# Altium schematic sheet Game of Simon.SchDoc
size A4
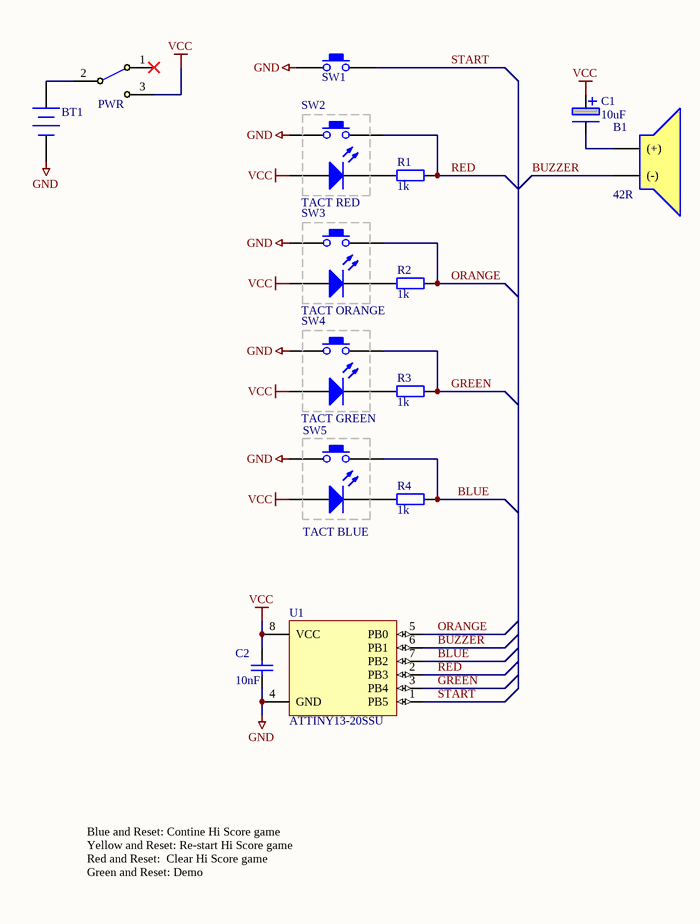
[diagram p0: Game of Simon.SchDoc]

## Parts
B1  42R  [BUZZER]
BT1  CR2032 Battery Holder  [CR2032 HOLDER]  (value not drawn)
C1  10uF  [CAP ELECTRO 5mm]
C2  10nF  [CAP 0.100"]
PWR  SS12D00G3  [SS12D00G3]  (value not drawn)
R1  1k  [RESISTOR 0.400"]
R2  1k  [RESISTOR 0.400"]
R3  1k  [RESISTOR 0.400"]
R4  1k  [RESISTOR 0.400"]
SW1  12MM TACT SWITCH  [12mm TACT THROUGH HOLE]  (value not drawn)
SW2  TACT RED  [ILLUMINATED TACT RED]
SW3  TACT ORANGE  [ILLUMINATED TACT ORANGE]
SW4  TACT GREEN  [ILLUMINATED TACT GREEN]
SW5  TACT BLUE  [ILLUMINATED TACT BLUE]
U1  ATTINY13-20SSU  [DIP-8]

## Nets
GND: BT1.2(-) C2.2 SW1.1 SW2.1 SW3.1 SW4.1 SW5.1 U1.4(GND)
VCC: C1.1 C2.1 PWR.3 SW2.K SW3.K SW4.K SW5.K U1.8(VCC)
BLUE: R4.2 SW5.2 U1.7(PB2)
BUZZER: B1.2((-)) U1.6(PB1)
GREEN: R3.2 SW4.2 U1.3(PB4)
ORANGE: R2.2 SW3.2 U1.5(PB0)
RED: R1.2 SW2.2 U1.2(PB3)
START: SW1.2 U1.1(PB5)
NetB1_1: B1.1((+)) C1.2
NetBT1_1: BT1.1(+) PWR.2
NetR1_1: R1.1 SW2.A
NetR2_1: R2.1 SW3.A
NetR3_1: R3.1 SW4.A
NetR4_1: R4.1 SW5.A

Not connected (* = marked no-connect by the designer): PWR 1*

## Notes on the sheet
- Blue and Reset: Contine Hi Score game
  Yellow and Reset: Re-start Hi Score game
  Red and Reset:  Clear Hi Score game
  Green and Reset: Demo
- LOW COST LABS
- Title
- Size:
- Date:
- A4
- Number:
- Revision:
- Sheet
- of
- File:

## Library data of the parts
B1 = BUZZER
BT1 = CMP-dvcba8mzfnv4aqscf1uc-2: CR2032 Battery Holder, Through Hole, Horizontal Mount; CustomComponentID: dvcba8mzfnv4aqscf1uc
C1 = CMP-su2zmkw1kc3z49ns9isd-1: 5mm Through Hole Electrolytic 2mm Pitch, 5mm height; CustomComponentID: su2zmkw1kc3z49ns9isd
C2 = CMP-f9eb30fd1b76262c-1: Capacitor, Ceramic, 10000pF, 50VDC, 20-% Tol, 20+% Tol, X7R-TC Code, -15, 15%-TC; Manufacturer Part Number: C315C103M5R5TA; Octopart URL: http://octopart.com/c315c103m5r5ta-kemet-1886203; RoHS: Compliant; Mounting Style: Through Hole; OctopartID: f9eb30fd1b76262c
PWR = SS12D00G3 Toggle Switch
R1-R4 = CMP-iaxfckaaxq3jb0c9euu5-1: RESISITOR THROUGH HOLE 1/4W; CustomComponentID: iaxfckaaxq3jb0c9euu5
SW1 = 12MM TACT SWITCH: CustomComponentID: pjmxh7vitsno3jubi8oz
SW2 = TACT RED: 12mm TACT SWITCH RED
SW3 = TACT ORANGE: 12mm TACT SWITCH ORANGE
SW4 = TACT GREEN: 12mm TACT SWITCH GREEN
SW5 = TACT BLUE: ILLUMINATED 12MM TACT SWITCH (BLUE); CustomComponentID: pjmxh7vitsno3jubi8oz
U1 = ATTINY13-20SSU: ATtiny Series 20 MHz 1 KB Flash 64 B SRAM 8-Bit Microcontroller - SOIC-8; MF: Microchip; MP: ATTINY13-20SSU; Price: None; Package: SO-8 Microchip; Availability: Unavailable; SnapEDA_Link: https://www.snapeda.com/parts/ATTINY13-20SSU/Microchip/view-part/?ref=snap; Value: *